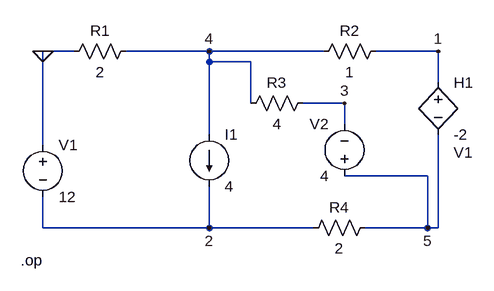
[diagram p0: schematic Draft1.asc]
Draft1.asc, the LTspice schematic file:
Version 4
SHEET 1 880 680
WIRE -144 48 -192 48
WIRE 64 48 -64 48
WIRE 240 48 64 48
WIRE 416 48 320 48
WIRE 64 64 64 48
WIRE 128 64 64 64
WIRE 416 96 416 48
WIRE 128 128 128 64
WIRE 272 128 208 128
WIRE 272 160 272 128
WIRE 64 176 64 64
WIRE -192 192 -192 48
WIRE 400 240 272 240
WIRE -192 320 -192 272
WIRE 64 320 64 256
WIRE 64 320 -192 320
WIRE 224 320 64 320
WIRE 400 320 400 240
WIRE 400 320 304 320
WIRE 416 320 416 176
WIRE 416 320 400 320
FLAG 416 48 1
FLAG 272 128 3
FLAG 64 48 4
FLAG 400 320 5
FLAG -192 48 0
FLAG 64 320 2
SYMBOL res -48 32 R90
WINDOW 0 0 56 VBottom 2
WINDOW 3 32 56 VTop 2
SYMATTR InstName R1
SYMATTR Value 2
SYMBOL res 336 32 R90
WINDOW 0 0 56 VBottom 2
WINDOW 3 32 56 VTop 2
SYMATTR InstName R2
SYMATTR Value 1
SYMBOL res 320 304 R90
WINDOW 0 0 56 VBottom 2
WINDOW 3 32 56 VTop 2
SYMATTR InstName R4
SYMATTR Value 2
SYMBOL voltage -192 176 R0
WINDOW 123 0 0 Left 0
WINDOW 39 0 0 Left 0
SYMATTR InstName V1
SYMATTR Value 12
SYMBOL current 64 176 R0
WINDOW 123 0 0 Left 0
WINDOW 39 0 0 Left 0
SYMATTR InstName I1
SYMATTR Value 4
SYMBOL res 224 112 R90
WINDOW 0 0 56 VBottom 2
WINDOW 3 32 56 VTop 2
SYMATTR InstName R3
SYMATTR Value 4
SYMBOL h 416 80 R0
WINDOW 38 24 124 Left 2
SYMATTR InstName H1
SYMATTR Value -2
SYMATTR SpiceModel V1
SYMBOL voltage 272 256 R180
WINDOW 0 24 96 Left 2
WINDOW 3 24 16 Left 2
WINDOW 123 0 0 Left 0
WINDOW 39 0 0 Left 0
SYMATTR InstName V2
SYMATTR Value 4
TEXT -226 370 Left 2 !.op

The netlist it stands for:
* Draft1.asc
R1 4 0 2
R2 1 4 1
R4 5 2 2
V1 0 2 12
I1 4 2 4
R3 3 4 4
H1 1 5 V1 -2
V2 5 3 4
.op
.backanno
.end

* Results of the author's LTspice run, read from the files saved beside the schematic
* Operating Point:
*   V(4) = -7.5 V
*   V(1) = -5 V
*   V(5) = -12.5 V
*   V(2) = -12 V
*   V(3) = -16.5 V
*   I(H1) = -2.5 A
*   I(I1) = 4 A
*   I(R3) = -2.25 A
*   I(R4) = -250 mA
*   I(R2) = 2.5 A
*   I(R1) = -3.75 A
*   I(V2) = -2.25 A
*   I(V1) = -3.75 A